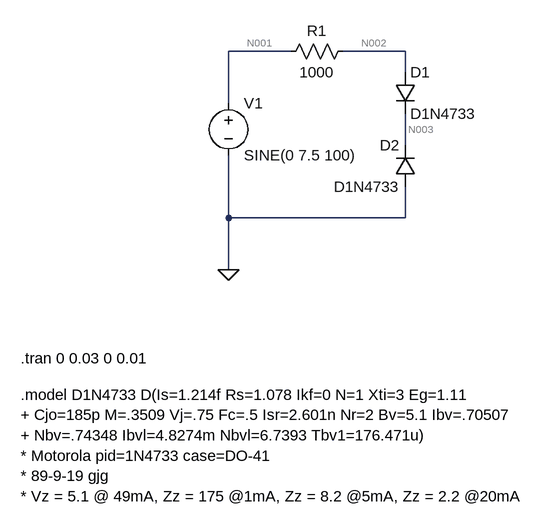
[diagram p0: schematic B1b.asc]
B1b.asc, the LTspice schematic file:
Version 4.1
SHEET 1 880 748
WIRE 144 64 48 64
WIRE 320 64 224 64
WIRE 320 96 320 64
WIRE 48 144 48 64
WIRE 320 208 320 160
WIRE 48 320 48 224
WIRE 320 320 320 272
WIRE 320 320 48 320
WIRE 48 400 48 320
FLAG 48 400 0
SYMBOL voltage 48 128 R0
WINDOW 123 0 0 Left 0
WINDOW 39 0 0 Left 0
SYMATTR InstName V1
SYMATTR Value SINE(0 7.5 100)
SYMBOL res 240 48 R90
WINDOW 0 0 56 VBottom 2
WINDOW 3 32 56 VTop 2
SYMATTR InstName R1
SYMATTR Value 1000
SYMBOL diode 304 96 R0
SYMATTR InstName D1
SYMATTR Value D1N4733
SYMBOL diode 336 272 R180
WINDOW 0 24 64 Left 2
WINDOW 3 24 0 Left 2
SYMATTR InstName D2
SYMATTR Value D1N4733
TEXT -272 592 Left 2 !.model D1N4733 D(Is=1.214f Rs=1.078 Ikf=0 N=1 Xti=3 Eg=1.11\n+ Cjo=185p M=.3509 Vj=.75 Fc=.5 Isr=2.601n Nr=2 Bv=5.1 Ibv=.70507\n+ Nbv=.74348 Ibvl=4.8274m Nbvl=6.7393 Tbv1=176.471u)\n* Motorola pid=1N4733 case=DO-41\n* 89-9-19 gjg\n* Vz = 5.1 @ 49mA, Zz = 175 @1mA, Zz = 8.2 @5mA, Zz = 2.2 @20mA
TEXT -272 536 Left 2 !.tran 0 0.03 0 0.01

The netlist it stands for:
* B1b.asc
V1 N001 0 SINE(0 7.5 100)
R1 N002 N001 1000
D1 N002 N003 D1N4733
D2 0 N003 D1N4733
.model D D
.lib standard.dio
.model D1N4733 D(Is=1.214f Rs=1.078 Ikf=0 N=1 Xti=3 Eg=1.11
+ Cjo=185p M=.3509 Vj=.75 Fc=.5 Isr=2.601n Nr=2 Bv=5.1 Ibv=.70507
+ Nbv=.74348 Ibvl=4.8274m Nbvl=6.7393 Tbv1=176.471u)
* Motorola pid=1N4733 case=DO-41
* 89-9-19 gjg
* Vz = 5.1 @ 49mA, Zz = 175 @1mA, Zz = 8.2 @5mA, Zz = 2.2 @20mA
.tran 0 0.03 0 0.01
.backanno
.end

* Results of the author's LTspice run, read from the files saved beside the schematic
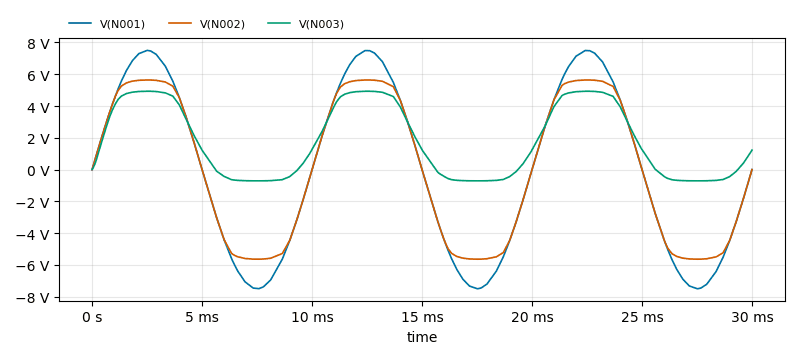
[diagram p1: Transient Analysis of B1b.asc, plotted from the saved traces]
* Transient Analysis, 1 run:
*   V(N001): min -7.499 V, max 7.5 V, average 143.8 µV, rms 5.312 V, last 0 V
*   V(N002): min -5.637 V, max 5.637 V, average -38.2 µV, rms 4.518 V, last -328.9 µV
*   V(N003): min -708.9 mV, max 4.928 V, average 1.775 V, rms 2.893 V, last 1.23 V